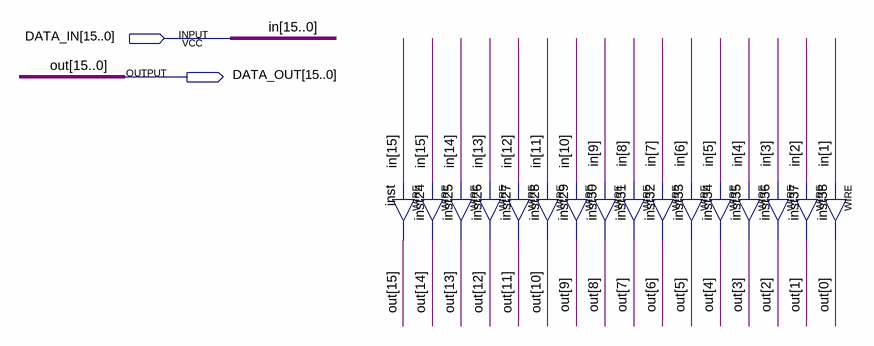
[diagram p0: schematic sheet]
// Quartus schematic ASR1.bdf as structural Verilog: 16 symbols, 2 pins
module ASR1 (
  input  [15:0] DATA_IN,
  output [15:0] DATA_OUT
);

  assign DATA_OUT[15] = DATA_IN[15];  // WIRE inst
  assign DATA_OUT[14] = DATA_IN[15];  // WIRE inst24
  assign DATA_OUT[13] = DATA_IN[14];  // WIRE inst25
  assign DATA_OUT[12] = DATA_IN[13];  // WIRE inst26
  assign DATA_OUT[11] = DATA_IN[12];  // WIRE inst27
  assign DATA_OUT[10] = DATA_IN[11];  // WIRE inst28
  assign DATA_OUT[9] = DATA_IN[10];  // WIRE inst29
  assign DATA_OUT[8] = DATA_IN[9];  // WIRE inst30
  assign DATA_OUT[7] = DATA_IN[8];  // WIRE inst31
  assign DATA_OUT[6] = DATA_IN[7];  // WIRE inst32
  assign DATA_OUT[5] = DATA_IN[6];  // WIRE inst33
  assign DATA_OUT[4] = DATA_IN[5];  // WIRE inst34
  assign DATA_OUT[3] = DATA_IN[4];  // WIRE inst35
  assign DATA_OUT[2] = DATA_IN[3];  // WIRE inst36
  assign DATA_OUT[1] = DATA_IN[2];  // WIRE inst37
  assign DATA_OUT[0] = DATA_IN[1];  // WIRE inst38

  // Other names for the same wires on the sheet: in[15:0] = DATA_IN; out[15:0] = DATA_OUT
endmodule
